# EAGLE schematic FDSSD (EAGLE 9.3.0)
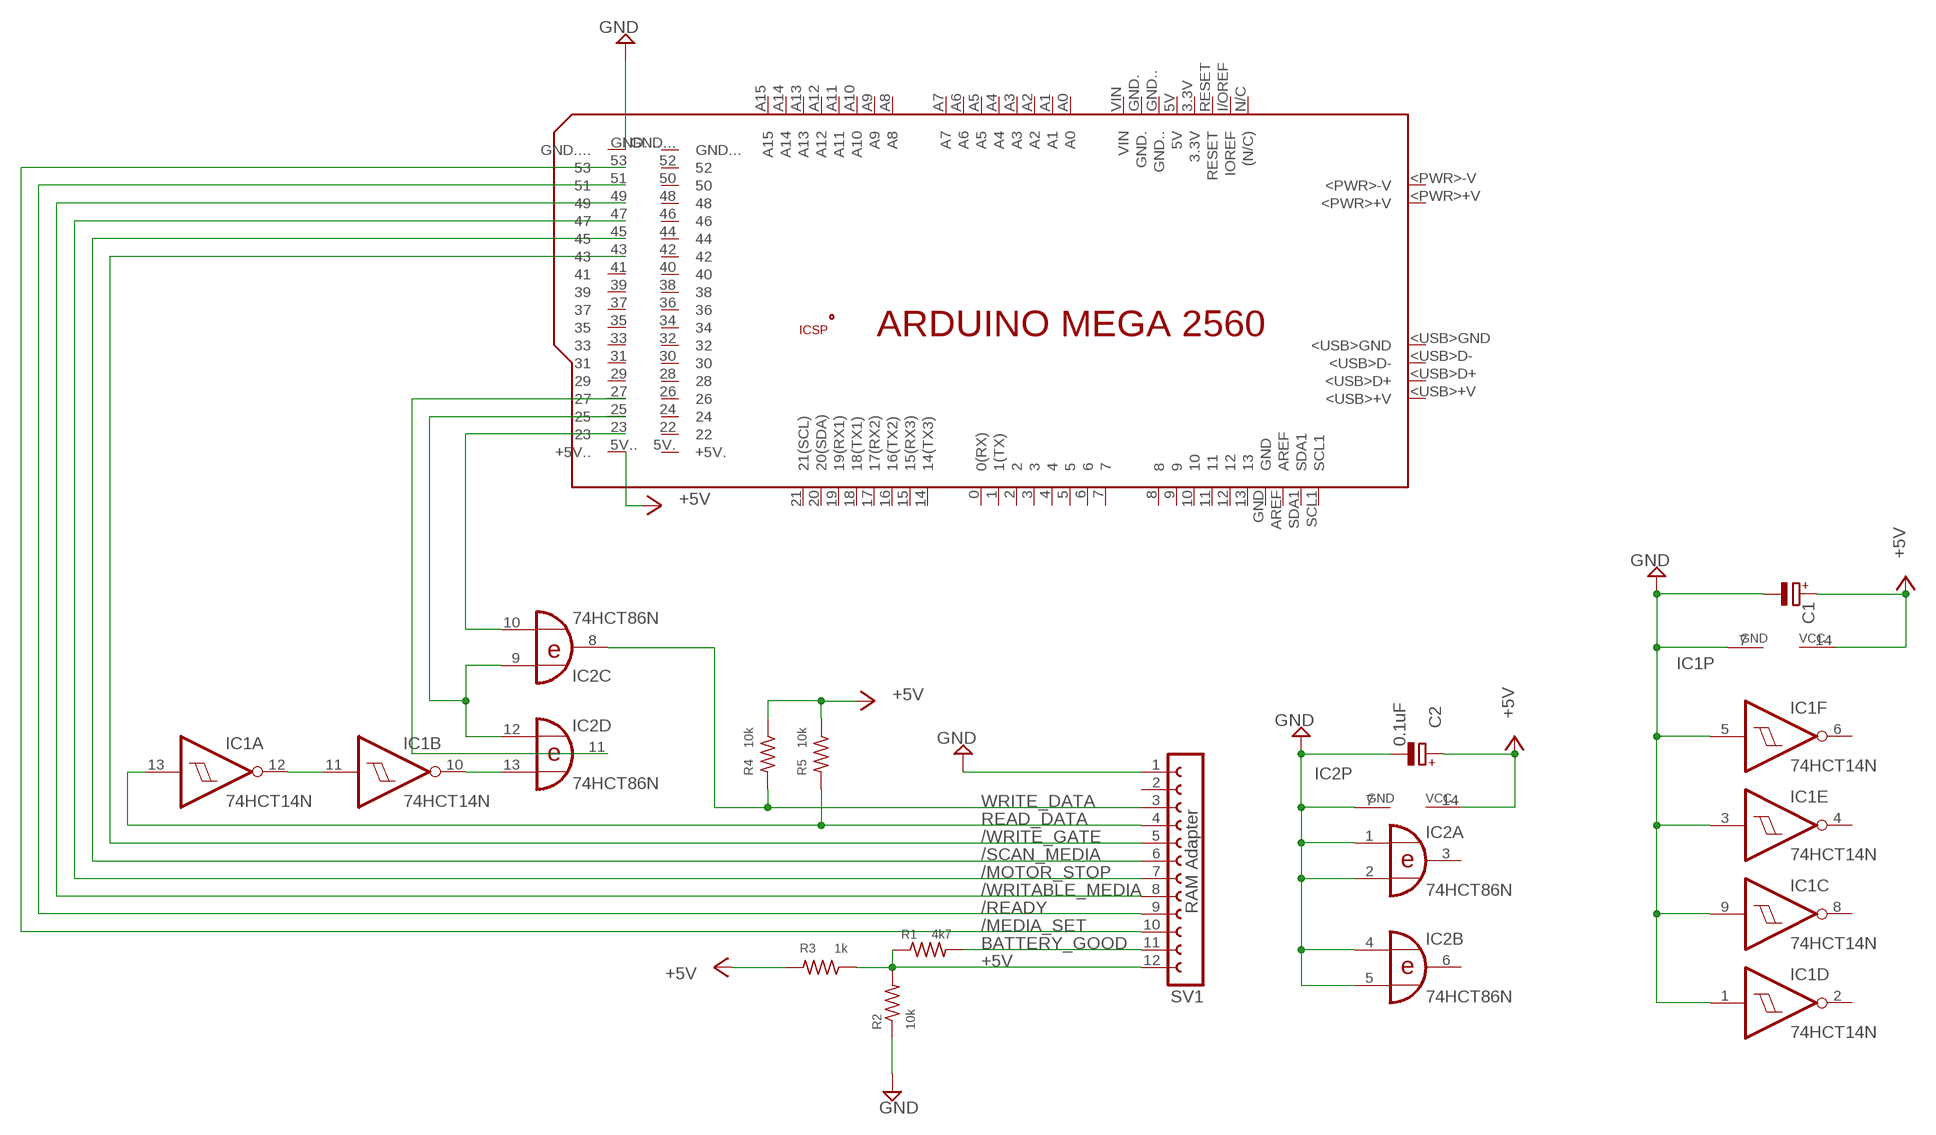
[diagram p0: schematic, sheet 1]

## Parts
C1  CPOL-EUE2.5-5  [E2,5-5]
C2  0.1uF  CPOL-EUE2.5-5  [E2,5-5]
IC1  74HCT14N  [DIL14]
IC2  74HCT86N  [DIL14]
PCB1  ARDUINO_MEGA2560  [ARDUINO_MEGA2560]
R1  4k7  R-US_0207/10  [0207/10]
R2  10k  R-US_0207/10  [0207/10]
R3  1k  R-US_0207/10  [0207/10]
R4  10k  R-US_0207/10  [0207/10]
R5  10k  R-US_0207/10  [0207/10]
SV1  RAM Adapter  FE12-1  [FE12]

## Nets
+5V: C1.+ C2.+ IC1.14(P:VCC) IC2.14(P:VCC) PCB1.5V..(+5V..) R1.1 R2.2 R3.1 R3.2 R4.1 R5.1 SV1.12
/MEDIA_SET: PCB1.53 SV1.10
/MOTOR_STOP: PCB1.47 SV1.7
/READY: PCB1.51 SV1.9
/SCAN_MEDIA: PCB1.45 SV1.6
/WRITABLE_MEDIA: PCB1.49 SV1.8
/WRITE_GATE: PCB1.43 SV1.5
BATTERY_GOOD: R1.2 SV1.11
GND: C1.- C2.- IC1.1(D:I) IC1.3(E:I) IC1.5(F:I) IC1.7(P:GND) IC1.9(C:I) IC2.1(A:I0) IC2.2(A:I1) IC2.4(B:I0) IC2.5(B:I1) IC2.7(P:GND) PCB1.GND.... R2.1 SV1.1
N$1: IC1.11(B:I) IC1.12(A:O)
N$2: IC1.10(B:O) IC2.13(D:I1)
N$3: IC2.9(C:I0) IC2.12(D:I0) PCB1.25
N$4: IC2.10(C:I1) PCB1.23
N$5: IC2.11(D:O) PCB1.27
READ_DATA: IC1.13(A:I) R5.2 SV1.4
WRITE_DATA: IC2.8(C:O) R4.2 SV1.3
Unconnected: IC1.2(D:O) IC1.4(E:O) IC1.6(F:O) IC1.8(C:O) IC2.3(A:O) IC2.6(B:O) PCB1.0(0(RX)) PCB1.1(1(TX)) PCB1.2 PCB1.3 PCB1.3.3V PCB1.4 PCB1.5 PCB1.5V PCB1.5V.(+5V.) PCB1.6 PCB1.7 PCB1.8 PCB1.9 PCB1.10 PCB1.11 PCB1.12 PCB1.13 PCB1.14(14(TX3)) PCB1.15(15(RX3)) PCB1.16(16(TX2)) PCB1.17(17(RX2)) PCB1.18(18(TX1)) PCB1.19(19(RX1)) PCB1.20(20(SDA)) PCB1.21(21(SCL)) PCB1.22 PCB1.24 PCB1.26 PCB1.28 PCB1.29 PCB1.30 PCB1.31 PCB1.32 PCB1.33 PCB1.34 PCB1.35 PCB1.36 PCB1.37 PCB1.38 PCB1.39 PCB1.40 PCB1.41 PCB1.42 PCB1.44 PCB1.46 PCB1.48 PCB1.50 PCB1.52 PCB1.+5V_ PCB1.<PWR>+V PCB1.<PWR>-V PCB1.<USB>+V PCB1.<USB>D+ PCB1.<USB>D- PCB1.<USB>GND PCB1.A0 PCB1.A1 PCB1.A2 PCB1.A3 PCB1.A4 PCB1.A5 PCB1.A6 PCB1.A7 PCB1.A8 PCB1.A9 PCB1.A10 PCB1.A11 PCB1.A12 PCB1.A13 PCB1.A14 PCB1.A15 PCB1.AREF PCB1.GND PCB1.GND. PCB1.GND.. PCB1.GND... PCB1.GND__ PCB1.I/OREF(IOREF) PCB1.MISO PCB1.MOSI PCB1.N/C((N/C)) PCB1.RESET PCB1.RESET. PCB1.SCK PCB1.SCL1 PCB1.SDA1 PCB1.VIN SV1.2

## Library data of the parts
C1 C2 = rcl:CPOL-EU: POLARIZED CAPACITOR, European symbol; SPICEPREFIX: C
IC1 = 74xx-eu:74*14: Hex schmitt trigger INVERTER
IC2 = 74xx-eu:74*86: Quad 2-input EXCLUSIVE-OR (XOR) gate
PCB1 = E14_Arduino_revC:ARDUINO_MEGA2560: Device for representing an Arduino Mega 2560 board with a footprint in an EAGLE design. Created by Dave Young for Element14. More EAGLE documentation at: http://www.element14.com/community/community/knode/cadsoft_eagle
R1-R5 = rcl:R-US_: RESISTOR, American symbol; SPICEPREFIX: R
SV1 = con-lsta:FE12-1: FEMALE HEADER; OC_FARNELL: unknown; OC_NEWARK: unknown